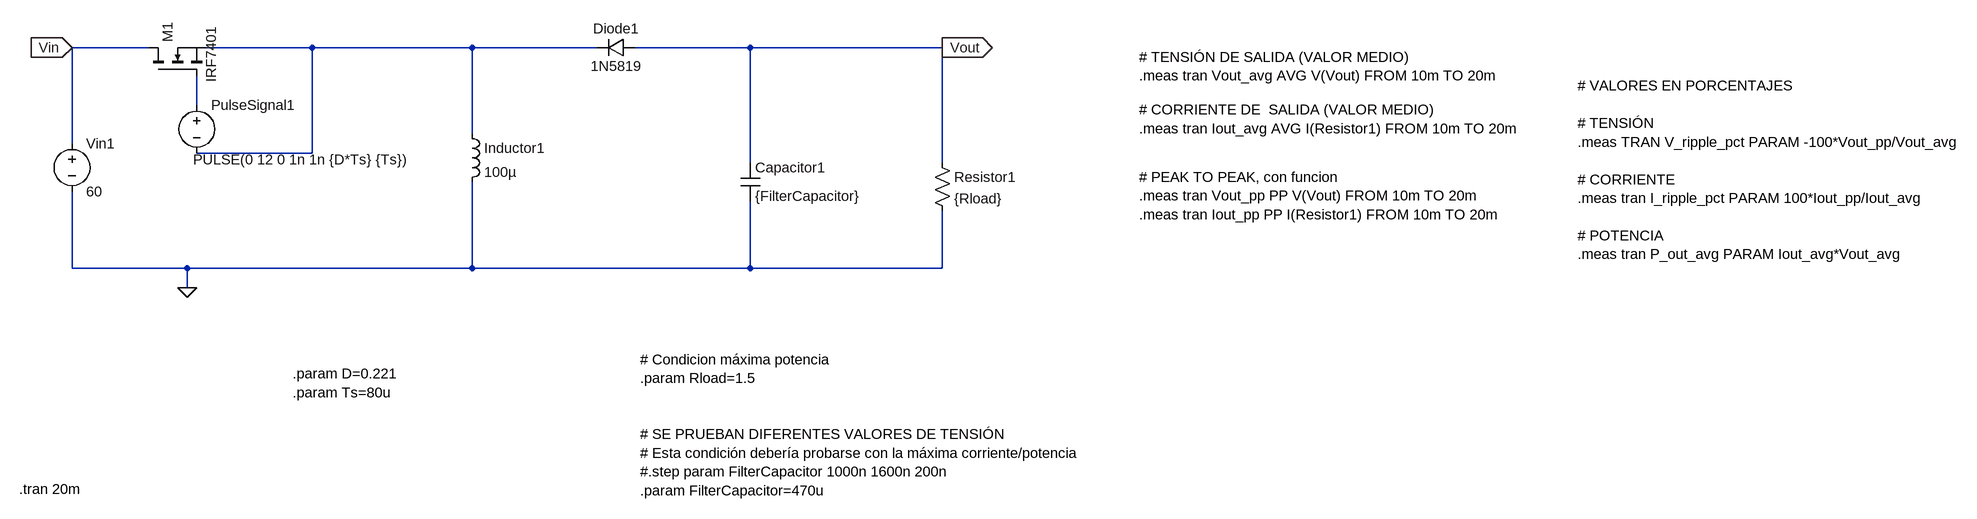
[diagram p0: schematic BuckBoost.asc]
BuckBoost.asc, the LTspice schematic file:
Version 4.1
SHEET 1 1972 680
WIRE -1392 -496 -1520 -496
WIRE -1120 -496 -1296 -496
WIRE -800 -496 -1120 -496
WIRE -592 -496 -800 -496
WIRE -336 -496 -528 -496
WIRE -16 -496 -336 -496
WIRE -1312 -400 -1312 -448
WIRE -800 -352 -800 -496
WIRE -1520 -336 -1520 -496
WIRE -1120 -320 -1120 -496
WIRE -1120 -320 -1312 -320
WIRE -336 -304 -336 -496
WIRE -16 -304 -16 -496
WIRE -1520 -128 -1520 -256
WIRE -1328 -128 -1520 -128
WIRE -800 -128 -800 -272
WIRE -800 -128 -1328 -128
WIRE -336 -128 -336 -240
WIRE -336 -128 -800 -128
WIRE -16 -128 -16 -224
WIRE -16 -128 -336 -128
WIRE -1328 -96 -1328 -128
FLAG -1328 -96 0
FLAG -1520 -496 Vin
IOPIN -1520 -496 In
FLAG -16 -496 Vout
IOPIN -16 -496 Out
SYMBOL ind -816 -368 R0
SYMATTR InstName Inductor1
SYMATTR Value 100µ
SYMATTR SpiceLine Rser=50m
SYMBOL cap -352 -304 R0
SYMATTR InstName Capacitor1
SYMATTR Value {FilterCapacitor}
SYMATTR SpiceLine Rser=5m
SYMBOL res -32 -320 R0
SYMATTR InstName Resistor1
SYMATTR Value {Rload}
SYMBOL voltage -1312 -416 R0
WINDOW 3 -6 107 Left 2
WINDOW 123 0 0 Left 0
WINDOW 39 0 0 Left 0
SYMATTR Value PULSE(0 12 0 1n 1n {D*Ts} {Ts})
SYMATTR InstName PulseSignal1
SYMBOL diode -528 -512 R90
WINDOW 0 0 32 VBottom 2
WINDOW 3 32 32 VTop 2
SYMATTR InstName Diode1
SYMATTR Value 1N5819
SYMBOL voltage -1520 -352 R0
WINDOW 123 0 0 Left 0
WINDOW 39 0 0 Left 0
SYMATTR InstName Vin1
SYMATTR Value 60
SYMBOL nmos -1392 -448 R270
WINDOW 3 -10 105 Left 2
SYMATTR Value IRF7401
SYMATTR InstName M1
TEXT -1152 48 Left 2 !.param D=0.221\n.param Ts=80u
TEXT 392 -480 Left 2 !# TENSIÓN DE SALIDA (VALOR MEDIO)\n.meas tran Vout_avg AVG V(Vout) FROM 10m TO 20m
TEXT 392 -392 Left 2 !# CORRIENTE DE  SALIDA (VALOR MEDIO)\n.meas tran Iout_avg AVG I(Resistor1) FROM 10m TO 20m
TEXT 392 -280 Left 2 !# PEAK TO PEAK, con funcion\n.meas tran Vout_pp PP V(Vout) FROM 10m TO 20m\n.meas tran Iout_pp PP I(Resistor1) FROM 10m TO 20m
TEXT 1288 -432 Left 2 !# VALORES EN PORCENTAJES\n \n# TENSIÓN\n.meas TRAN V_ripple_pct PARAM -100*Vout_pp/Vout_avg\n \n# CORRIENTE\n.meas tran I_ripple_pct PARAM 100*Iout_pp/Iout_avg\n \n# POTENCIA\n.meas tran P_out_avg PARAM Iout_avg*Vout_avg
TEXT -520 24 Left 2 !# Condicion máxima potencia\n.param Rload=1.5\n \n \n# SE PRUEBAN DIFERENTES VALORES DE TENSIÓN\n# Esta condición debería probarse con la máxima corriente/potencia\n#.step param FilterCapacitor 1000n 1600n 200n\n.param FilterCapacitor=470u
TEXT -1608 240 Left 2 !.tran 20m

The netlist it stands for:
* BuckBoost.asc
L§Inductor1 N001 0 100µ Rser=50m
Capacitor1 Vout 0 {FilterCapacitor} Rser=5m
Resistor1 Vout 0 {Rload}
V§PulseSignal1 N002 N001 PULSE(0 12 0 1n 1n {D*Ts} {Ts})
Diode1 Vout N001 1N5819
Vin1 Vin 0 60
M1 Vin N002 N001 N001 IRF7401
.model D D
.lib standard.dio
.model NMOS NMOS
.model PMOS PMOS
.lib standard.mos
.param D=0.221
.param Ts=80u
# TENSIÓN DE SALIDA (VALOR MEDIO)
.meas tran Vout_avg AVG V(Vout) FROM 10m TO 20m
# CORRIENTE DE  SALIDA (VALOR MEDIO)
.meas tran Iout_avg AVG I(Resistor1) FROM 10m TO 20m
# PEAK TO PEAK, con funcion
.meas tran Vout_pp PP V(Vout) FROM 10m TO 20m
.meas tran Iout_pp PP I(Resistor1) FROM 10m TO 20m
# VALORES EN PORCENTAJES
# TENSIÓN
.meas TRAN V_ripple_pct PARAM -100*Vout_pp/Vout_avg
# CORRIENTE
.meas tran I_ripple_pct PARAM 100*Iout_pp/Iout_avg
# POTENCIA
.meas tran P_out_avg PARAM Iout_avg*Vout_avg
# Condicion máxima potencia
.param Rload=1.5
# SE PRUEBAN DIFERENTES VALORES DE TENSIÓN
# Esta condición debería probarse con la máxima corriente/potencia
#.step param FilterCapacitor 1000n 1600n 200n
.param FilterCapacitor=470u
.tran 20m
.backanno
.end